# Altium schematic sheet LCD.SchDoc: Motor Monitoring
size A3; Organization: NTUST EE-305; Address1: No.43, Sec. 4, Keelung Rd.; Address2: Da’an Dist.; Address3: Taipei 106; Address4: Taiwan (R.O.C.); Revision: 2.0; SheetNumber: 1; SheetTotal: 4
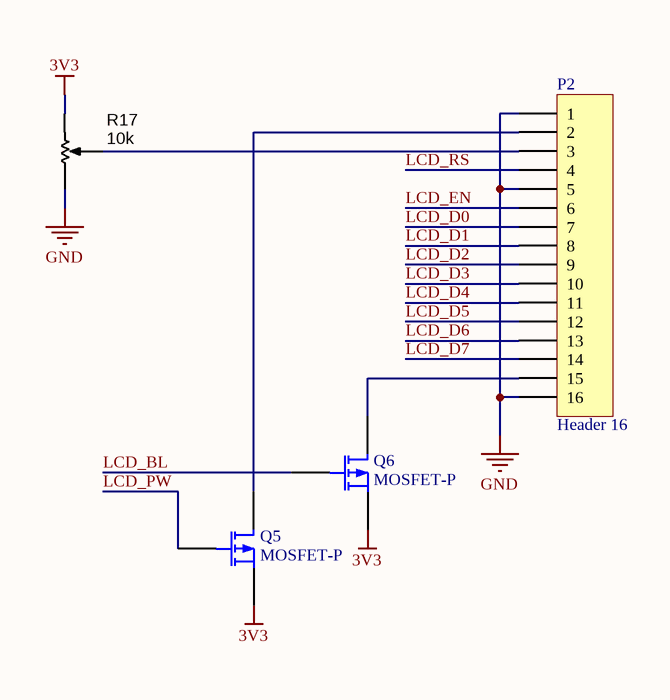
[diagram p0: LCD.SchDoc]

## Parts
P2  Header 16  [HDR1X16]
Q5  MOSFET-P  [SOT23-3N]
Q6  MOSFET-P  [SOT23-3N]
R17  value 10k  [RES_TRIMMER_SMD_TC33X1]  (hidden comment: RES_TRIMMER_10K_5T_SMD)

## Nets
3V3: Q5.2(S) Q6.2(S) R17.3(CW)
GND: P2.1 P2.5 P2.16 R17.1(CCW)
LCD_BL: Q6.1(G)
LCD_D0: P2.7
LCD_D1: P2.8
LCD_D2: P2.9
LCD_D3: P2.10
LCD_D4: P2.11
LCD_D5: P2.12
LCD_D6: P2.13
LCD_D7: P2.14
LCD_EN: P2.6
LCD_PW: Q5.1(G)
LCD_RS: P2.4
NetP2_2: P2.2 Q5.3(D)
NetP2_3: P2.3 R17.2(WIPER)
NetP2_15: P2.15 Q6.3(D)

## Notes on the sheet
- Title
- Name
- Size:
- Revision:
- A3
- Date:
- Time:
- Sheet
- of

## Library data of the parts
P2 = Header 16: Header, 16-Pin; LatestRevisionDate: 17-Jul-2002; LatestRevisionNote: Re-released for DXP Platform.; Publisher: Altium Limited
Q5 Q6 = MOSFET-P: P-Channel MOSFET; Published: 8-Jun-2000; LatestRevisionDate: 17-Jul-2002; LatestRevisionNote: Re-released for DXP Platform.; PackageVersion: 1995/1996; PackageReference: E3; Publisher: Altium Limited; PackageDescription: TO, Flat Index; 3 In-Line, Axial Leads; Body Dia. 4.6mm; Lead Dia. 0.5 mm (max)
R17 = RES_TRIMMER_10K_5T_SMD: Trimmer SMD 10K 250mW 5-turn Side-adjust; Manufacturer 1: Bourns Inc.; Manufacturer Part Number 1: 3214G-1-103E; Tolerance: 10%; Ratings: 5 turn variable cermet; Number of Turns: 5; Supplier 1: Digi-Key; Supplier Part Number 1: 3214G-1-103ECT-ND